# EAGLE design rocket_pack-pad (EAGLE 6.3)
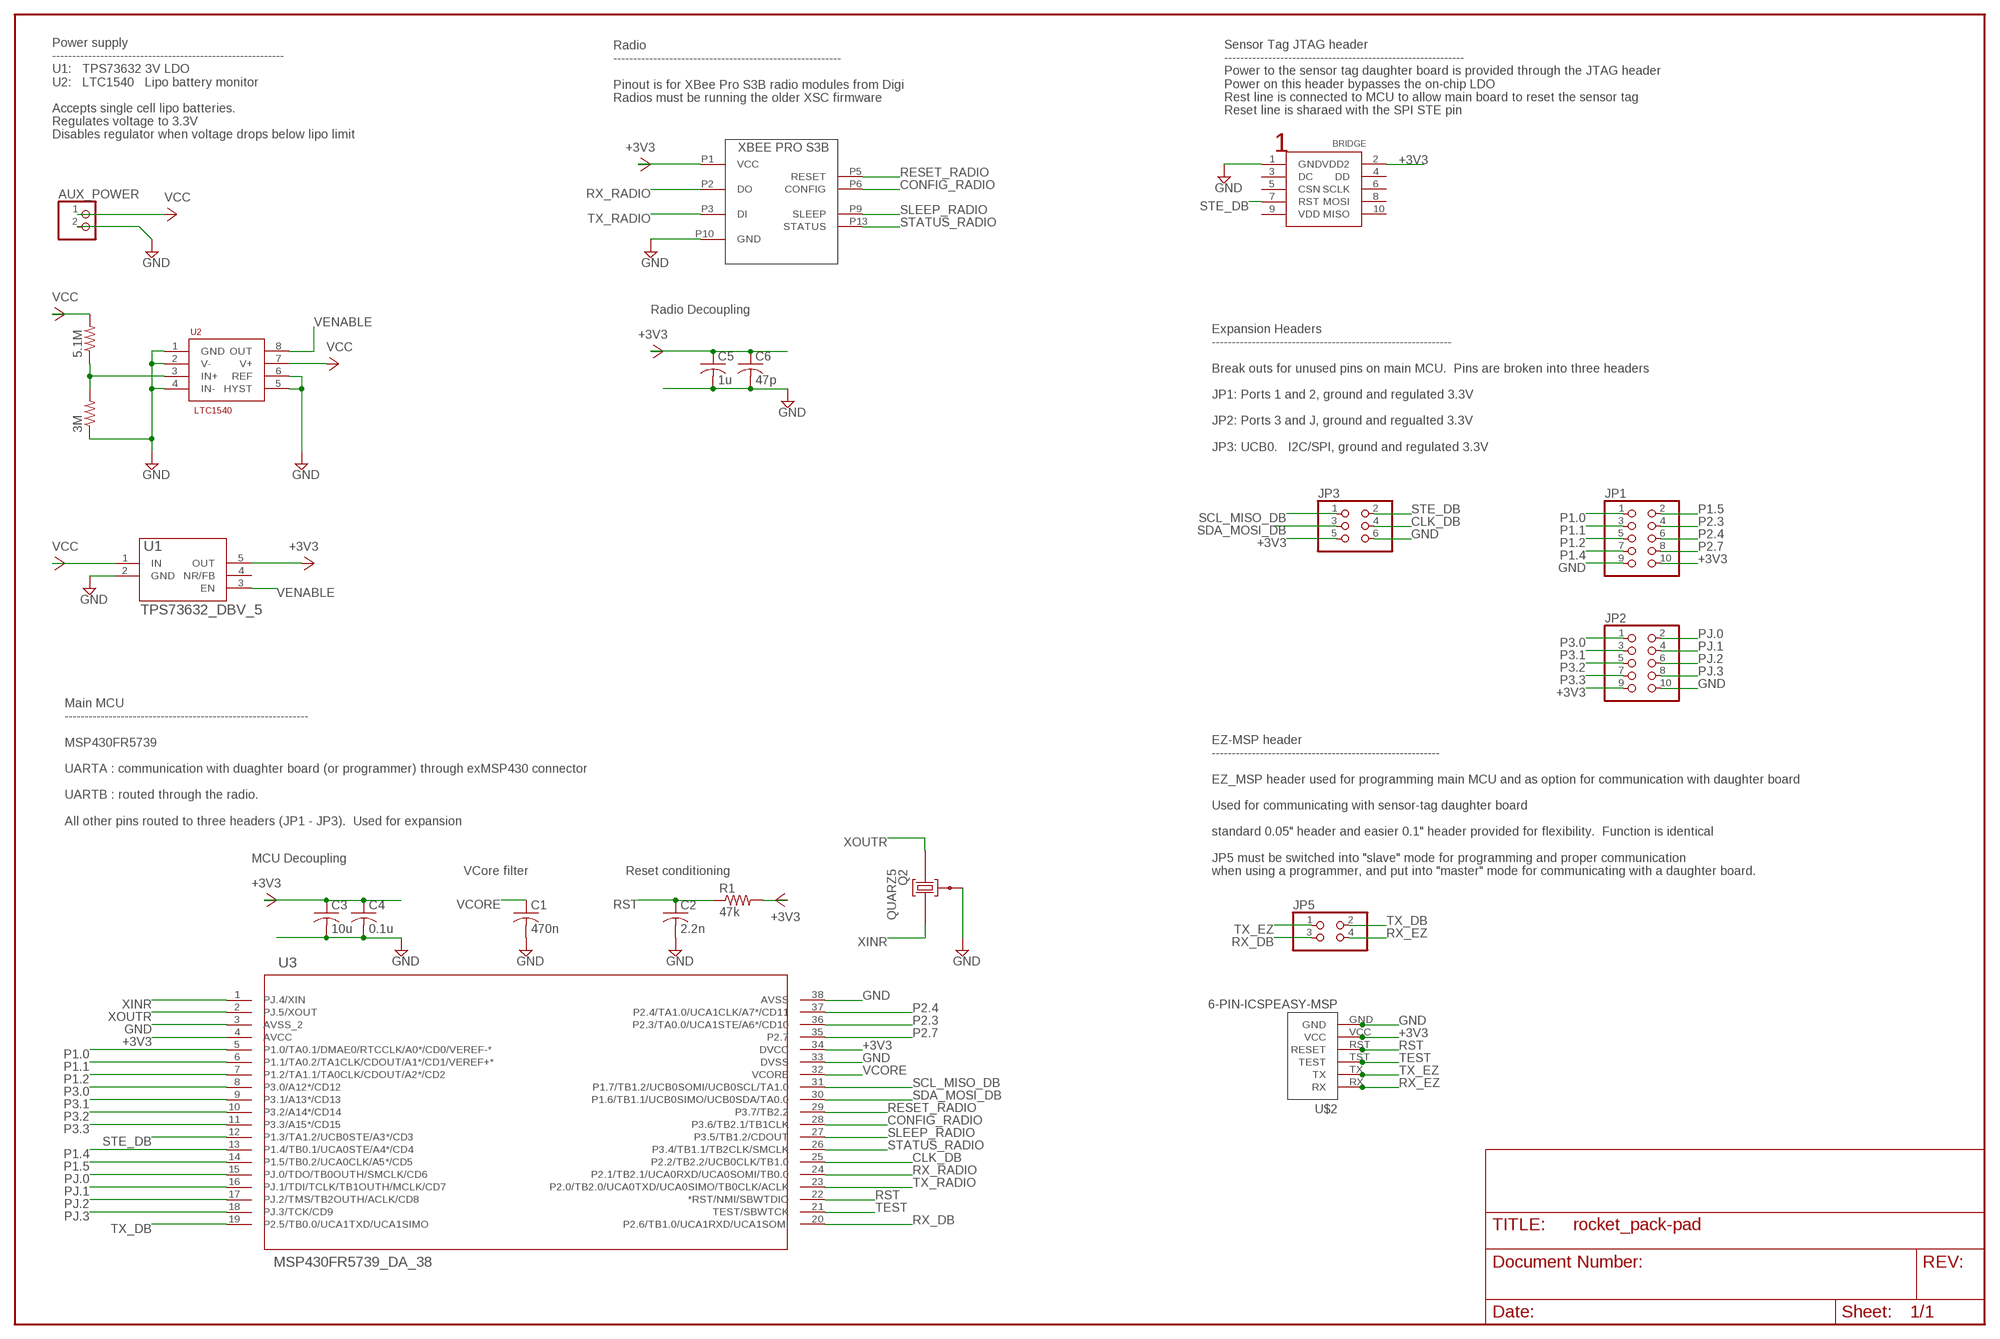
[diagram p0: schematic, sheet 1]

## Parts
3M  R-US_R1206  [R1206]
5.1M  R-US_R1206  [R1206]
AUX_POWER  PINHD-1X2  [1X02]
BRIDGE  CC-DEBUG  [2X5-1.27MM]
C1  470n  C-USC1206  [C1206]
C2  2.2n  C-USC1206  [C1206]
C3  10u  C-USC1206  [C1206]
C4  0.1u  C-USC1206  [C1206]
C5  1u  C-USC1206  [C1206]
C6  47p  C-USC1206  [C1206]
JP1  PINHD-2X5  [2X05]
JP2  PINHD-2X5  [2X05]
JP3  PINHD-2X3  [2X03]
JP5  PINHD-2X2  [2X02]
Q2  QUARZ5  [QUARZ5]
R1  47k  R-US_R1206  [R1206]
U1  TPS73632_DBV_5  [DBV5]
U2  LTC1540  [S8]
U3  MSP430FR5739_DA_38  [DA38]
U$1  XBEE_PRO_S3B  [PRO_S3B]
U$2  6-PIN-ICSPEASY-MSP  [EASYMSP-6PIN]

## Nets
+3V3: BRIDGE.2(VDD2) C3.1 C4.1 C5.1 C6.1 JP1.10 JP2.9 JP3.5 R1.2 U1.5(OUT) U3.4(AVCC) U3.34(DVCC) U$1.P1(VCC) U$2.VCC
CLK_DB: JP3.4 U3.25(P2.2/TB2.2/UCB0CLK/TB1.0)
CONFIG_RADIO: U3.28(P3.6/TB2.1/TB1CLK) U$1.P6(CONFIG)
GND: 3M.1 AUX_POWER.2 BRIDGE.1(GND) C1.2 C2.2 C3.2 C4.2 C5.2 C6.2 JP1.9 JP2.10 JP3.6 Q2.GND@0 U1.2(GND) U2.1(GND) U2.2(V-) U2.4(IN-) U2.5(HYST) U2.6(REF) U3.3(AVSS_2) U3.33(DVSS) U3.38(AVSS) U$1.P10(GND) U$2.GND
N$1: 3M.2 5.1M.1 U2.3(IN+)
P1.0: JP1.1 U3.5(P1.0/TA0.1/DMAE0/RTCCLK/A0*/CD0/VEREF-*)
P1.1: JP1.3 U3.6(P1.1/TA0.2/TA1CLK/CDOUT/A1*/CD1/VEREF+*)
P1.2: JP1.5 U3.7(P1.2/TA1.1/TA0CLK/CDOUT/A2*/CD2)
P1.4: JP1.7 U3.13(P1.4/TB0.1/UCA0STE/A4*/CD4)
P1.5: JP1.2 U3.14(P1.5/TB0.2/UCA0CLK/A5*/CD5)
P2.3: JP1.4 U3.36(P2.3/TA0.0/UCA1STE/A6*/CD10)
P2.4: JP1.6 U3.37(P2.4/TA1.0/UCA1CLK/A7*/CD11)
P2.7: JP1.8 U3.35(P2.7)
P3.0: JP2.1 U3.8(P3.0/A12*/CD12)
P3.1: JP2.3 U3.9(P3.1/A13*/CD13)
P3.2: JP2.5 U3.10(P3.2/A14*/CD14)
P3.3: JP2.7 U3.11(P3.3/A15*/CD15)
PJ.0: JP2.2 U3.15(PJ.0/TDO/TB0OUTH/SMCLK/CD6)
PJ.1: JP2.4 U3.16(PJ.1/TDI/TCLK/TB1OUTH/MCLK/CD7)
PJ.2: JP2.6 U3.17(PJ.2/TMS/TB2OUTH/ACLK/CD8)
PJ.3: JP2.8 U3.18(PJ.3/TCK/CD9)
RESET_RADIO: U3.29(P3.7/TB2.2) U$1.P5(RESET)
RST: C2.1 R1.1 U3.22(*RST/NMI/SBWTDIO) U$2.RST(RESET)
RX_DB: JP5.3 U3.20(P2.6/TB1.0/UCA1RXD/UCA1SOMI)
RX_EZ: JP5.4 U$2.RX
RX_RADIO: U3.24(P2.1/TB2.1/UCA0RXD/UCA0SOMI/TB0.0) U$1.P2(DO)
SCL_MISO_DB: JP3.1 U3.31(P1.7/TB1.2/UCB0SOMI/UCB0SCL/TA1.0)
SDA_MOSI_DB: JP3.3 U3.30(P1.6/TB1.1/UCB0SIMO/UCB0SDA/TA0.0)
SLEEP_RADIO: U3.27(P3.5/TB1.2/CDOUT) U$1.P9(SLEEP)
STATUS_RADIO: U3.26(P3.4/TB1.1/TB2CLK/SMCLK) U$1.P13(STATUS)
STE_DB: BRIDGE.7(RST) JP3.2 U3.12(P1.3/TA1.2/UCB0STE/A3*/CD3)
TEST: U3.21(TEST/SBWTCK) U$2.TST(TEST)
TX_DB: JP5.2 U3.19(P2.5/TB0.0/UCA1TXD/UCA1SIMO)
TX_EZ: JP5.1 U$2.TX
TX_RADIO: U3.23(P2.0/TB2.0/UCA0TXD/UCA0SIMO/TB0CLK/ACLK) U$1.P3(DI)
VCC: 5.1M.2 AUX_POWER.1 U1.1(IN) U2.7(V+)
VCORE: C1.1 U3.32(VCORE)
VENABLE: U1.3(EN) U2.8(OUT)
XINR: Q2.1 U3.1(PJ.4/XIN)
XOUTR: Q2.2 U3.2(PJ.5/XOUT)
Unconnected: BRIDGE.3(DC) BRIDGE.4(DD) BRIDGE.5(CSN) BRIDGE.6(SCLK) BRIDGE.8(MOSI) BRIDGE.9(VDD) BRIDGE.10(MISO) U1.4(NR/FB)

## Notes on the sheet
- Radio
  ---------------------------------------------------------
  
  Pinout is for XBee Pro S3B radio modules from Digi
  Radios must be running the older XSC firmware
- Sensor Tag JTAG header
  ------------------------------------------------------------
  Power to the sensor tag daughter board is provided through the JTAG header
  Power on this header bypasses the on-chip LDO
  Rest line is connected to MCU to allow main board to reset the sensor tag
  Reset line is sharaed with the SPI STE pin
- Power supply
  ----------------------------------------------------------
  U1:   TPS73632 3V LDO
  U2:   LTC1540   Lipo battery monitor
  
  Accepts single cell lipo batteries.  
  Regulates voltage to 3.3V
  Disables regulator when voltage drops below lipo limit
- Radio Decoupling
- Expansion Headers
  ------------------------------------------------------------
  
  Break outs for unused pins on main MCU.  Pins are broken into three headers
  
  JP1: Ports 1 and 2, ground and regulated 3.3V
  
  JP2: Ports 3 and J, ground and regualted 3.3V
  
  JP3: UCB0.   I2C/SPI, ground and regulated 3.3V
- Main MCU
  -------------------------------------------------------------
  
  MSP430FR5739
  
  UARTA : communication with duaghter board (or programmer) through exMSP430 connector
  
  UARTB : routed through the radio.  
  
  All other pins routed to three headers (JP1 - JP3).  Used for expansion
- MCU Decoupling
- VCore filter | Reset conditioning
- EZ-MSP header
  ---------------------------------------------------------
  
  EZ_MSP header used for programming main MCU and as option for communication with daughter board
  
  Used for communicating with sensor-tag daughter board
  
  standard 0.05" header and easier 0.1" header provided for flexibility.  Function is identical
  
  JP5 must be switched into "slave" mode for programming and proper communication
  when using a programmer, and put into "master" mode for communicating with a daughter board.

## Library data of the parts
3M 5.1M R1 = adafruit:R-US_: RESISTOR, American symbol
AUX_POWER = pinhead:PINHD-1X2: PIN HEADER
BRIDGE = connectors:CC-DEBUG
C1-C6 = adafruit:C-US: CAPACITOR, American symbol
JP1 JP2 = pinhead:PINHD-2X5: PIN HEADER
JP3 = pinhead:PINHD-2X3: PIN HEADER
JP5 = pinhead:PINHD-2X2: PIN HEADER
Q2 = sMSP430:QUARZ5
U1 = TexasInstruments:TPS73632_DBV_5; DATASHEETURL: http://www.ti.com/lit/gpn/TPS73632; DESCRIPTION: Single Output LDO, 400mA, Fixed(3.2V), Cap free, Low Noise, Reverse Current Protection; FAMILY_NAME: SINGLE CHANNEL LDO; GENERIC_PART_NUMBER: TPS73632; INDUSTRY_STD_PKG_TYPE: SOT-23; MANUFACTURER: Texas Instruments; MANUFACTURER_PART_NUMBER: tps73632_dbv_5; PACKAGE_DESIGNATOR: DBV; PIN_COUNT: 5; VENDOR: Texas Instruments
U2 = linear:LTC1540
U3 = TexasInstruments:MSP430FR5739_DA_38; DATASHEETURL: http://www.ti.com/lit/gpn/MSP430FR5739; DESCRIPTION: MSP430FR573x,MSP430FR572x Mixed Signal Microcontroller; FAMILY_NAME: FRAM Series; GENERIC_PART_NUMBER: MSP430FR5739; INDUSTRY_STD_PKG_TYPE: TSSOP; MANUFACTURER: Texas Instruments; MANUFACTURER_PART_NUMBER: msp430fr5739_da_38; PACKAGE_DESIGNATOR: DA; PIN_COUNT: 38; VENDOR: Texas Instruments
U$1 = xbee:XBEE_PRO_S3B
U$2 = LaunchFET:6-PIN-ICSP: 6 pin easy-msp formatted headers. Designed to make programming target boards with MSP430 Launchpad easier. EASYMSP: standard .05" pitch header to match launchpad SAFEMSP: .05" header with .025" offset Vcc to keep Geordi away

## Board
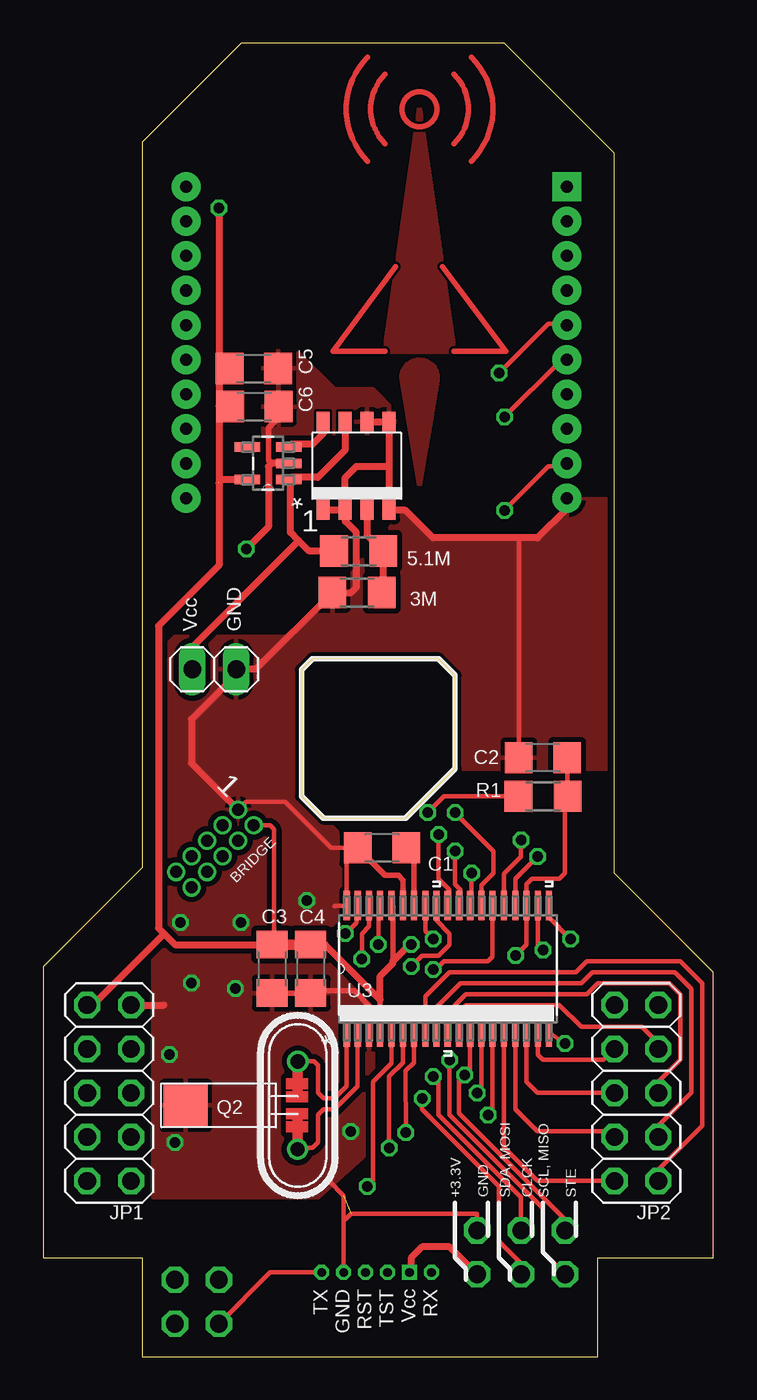
[diagram p1: board, top side]
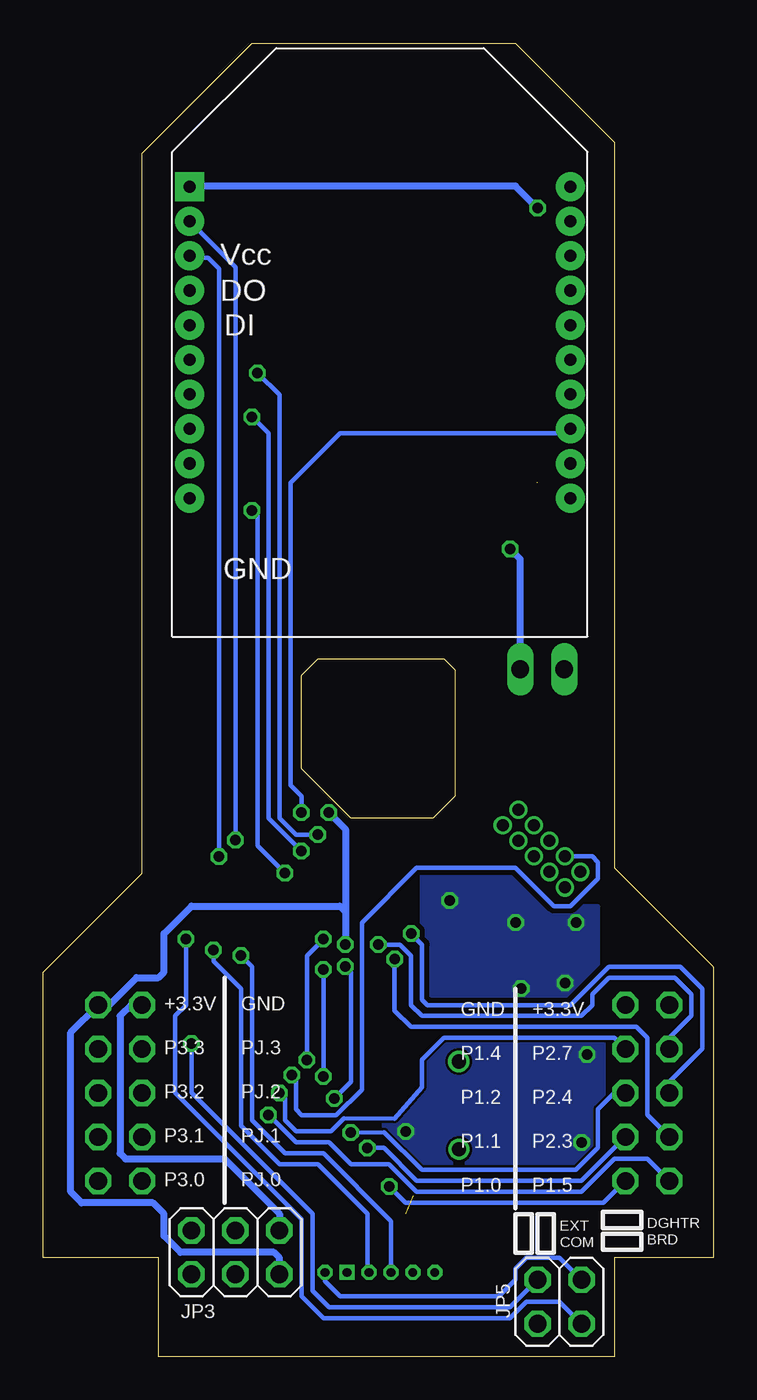
[diagram p2: board, bottom side, seen from below]

Size 38.74 x 75.88 mm. Coordinates in mm from the lower left corner, seen from the top.
Outline: 23.81,39.37 22.86,40.32 15.56,40.32 14.92,39.69 14.92,32.38 16.19,31.12 20.95,31.12 23.81,33.97 23.81,39.37
Outline: 32.07,0 32.07,5.72 38.74,5.72 38.74,22.22 33.02,27.94 33.02,69.53 26.67,75.88 11.43,75.88 5.71,70.17 5.71,28.26 0,22.54 0,5.72 5.71,5.72 5.71,0 32.07,0
Copper layers (1*16): Top 0.0356mm / dielectric 1.5011mm / Bottom 0.0356mm
Design rules "oshpark *": minimum track width 6mil, minimum drill 13mil, track to track 6mil, track to pad 6mil, pad to pad 6mil, via to via 6mil, smd to smd 6mil, copper to edge 15mil, drill to drill 6mil, minimum pad ring 7mil, minimum via ring 7mil, stop-mask expansion 4mil, vias tented up to drill 24mil, thermal gap 10mil

### Footprints (pad centres in the part's own frame; a part is rotated, then mirrored left to right if it is on the bottom)
R1206 = smd 1.6 x 1.803: 1 -1.422,0; 2 1.422,0
1X02 = drill 1.016 long: 1 -1.27,0; 2 1.27,0
2X5-1.27MM = drill 0.7 pad 1.016: 1 0,0; 2 0,1.27; 3 1.27,0; 4 1.27,1.27; 5 2.54,0; 6 2.54,1.27; 7 3.81,0; 8 3.81,1.27; 9 5.08,0; 10 5.08,1.27
C1206 = smd 1.6 x 1.8: 1 -1.4,0; 2 1.4,0
2X05 = drill 1.016 octagon: 1 -5.08,-1.27; 2 -5.08,1.27; 3 -2.54,-1.27; 4 -2.54,1.27; 5 0,-1.27; 6 0,1.27; 7 2.54,-1.27; 8 2.54,1.27; 9 5.08,-1.27; 10 5.08,1.27
2X03 = drill 1.016 octagon: 1 -2.54,-1.27; 2 -2.54,1.27; 3 0,-1.27; 4 0,1.27; 5 2.54,-1.27; 6 2.54,1.27
2X02 = drill 1.016 octagon: 1 -1.27,-1.27; 2 -1.27,1.27; 3 1.27,-1.27; 4 1.27,1.27
QUARZ5 = drill 0.813: 1 1.53,1.773; 2 1.52,-3.303 | smd 2.54 x 2.54: GND@0 -4.941,-0.762
DBV5 = smd 1.473 x 0.559: 1 -1.194,0.94; 2 -1.194,0; 3 -1.194,-0.94; 4 1.194,-0.94; 5 1.194,0.94
S8 = smd 0.762 x 1.143: 1 -2.54,-2.54; 2 -1.27,-2.54; 3 0,-2.54; 4 1.27,-2.54; 5 1.27,2.54; 6 0,2.54; 7 -1.27,2.54; 8 -2.54,2.54
DA38 = smd 1.676 x 0.356: 1 -3.658,5.842; 2 -3.658,5.207; 3 -3.658,4.547; 4 -3.658,3.912; 5 -3.658,3.251; 6 -3.658,2.591; 7 -3.658,1.956; 8 -3.658,1.295; 9 -3.658,0.66; 10 -3.658,0; 11 -3.658,-0.66; 12 -3.658,-1.295; 13 -3.658,-1.956; 14 -3.658,-2.591; 15 -3.658,-3.251; 16 -3.658,-3.912; 17 -3.658,-4.547; 18 -3.658,-5.207; 19 -3.658,-5.842; 20 3.658,-5.842; 21 3.658,-5.207; 22 3.658,-4.547; 23 3.658,-3.912; 24 3.658,-3.251; 25 3.658,-2.591; 26 3.658,-1.956; 27 3.658,-1.295; 28 3.658,-0.66; 29 3.658,0; 30 3.658,0.66; 31 3.658,1.295; 32 3.658,1.956; 33 3.658,2.591; 34 3.658,3.251; 35 3.658,3.912; 36 3.658,4.547; 37 3.658,5.207; 38 3.658,5.842
PRO_S3B = drill 0.7 pad 1.676 square: P1 -11,0 | drill 0.7 pad 1.676: P2 -11,-2; P3 -11,-4; P4 -11,-6; P5 -11,-8; P6 -11,-10; P7 -11,-12; P8 -11,-14; P9 -11,-16; P10 -11,-18; P11 11,-18; P12 11,-16; P13 11,-14; P14 11,-12; P15 11,-10; P16 11,-8; P17 11,-6; P18 11,-4; P19 11,-2; P20 11,0
EASYMSP-6PIN = drill 0.5 octagon: GND 0,-1.27; RST 0,0; RX 0,3.81; TST 0,1.27; TX 0,-2.54 | drill 0.5 square: VCC 0,2.54

### Placement (x,y rotation side)
3M  18.14,44.15 0 top
5.1M  18.23,46.54 180 top
AUX_POWER  9.88,39.72 0 top
BRIDGE  11.27,31.6 225 top
C1  19.58,29.4 180 top
C2  28.89,34.61 180 top
C3  13.23,22.41 270 top
C4  15.45,22.41 270 top
C5  12.17,57.1 0 top
C6  12.2,54.89 0 top
JP1  3.81,15.24 90 top
JP2  34.29,15.24 90 top
JP3  27.62,6.03 0 bottom
JP5  8.89,3.17 0 bottom
Q2  13.18,15.29 0 top
R1  28.89,32.38 180 top
U1  12.99,51.61 180 top
U2  18.72,51.47 0 top
U3  23.39,22.41 90 top
U$1  19.27,67.6 0 bottom
U$2  18.63,4.87 270 top

### Tracks (layer width: path | path; a pad name or v marks a point on that pad's centre or on a via)
+3V3  (via drill 0.6)  (1 unrouted)
  Top 0.254: BRIDGE.2 13.11,30.7 13.33,30.48 13.33,23.92 C3.1 | R1.2 23.18,32.38 v22.22,31.43 | v21.27,23.81 21.16,23.81
  Top 0.305: U3.4 19.47,20.64 | 20.21,22.73 20.21,22.86 20.21,25.99 U3.34 | C6.1 10.19,54.89
  Top 0.406: 20.21,22.73 19.47,21.99 19.47,20.64 16.3,23.81 C4.1 | U1.5 10.35,50.67 10.16,50.48 10.16,45.72 6.67,42.23 6.67,24.77 6.98,24.45 | 6.98,24.45 7.62,23.81 C3.1 | JP1.10 2.86,20.32 6.98,24.45 | 21.16,23.81 20.21,22.86 | v10.16,66.36 10.16,57.15 | 10.16,57.15 10.17,54.93 | 10.17,54.93 10.18,50.51 | C5.1 10.21,57.1 10.16,57.15 | C6.1 10.2,54.89 10.17,54.93 | JP3.5 23.5,6.35 21.91,6.35 21.27,5.72 21.27,4.97 U$2.VCC
  Top 0.61: C3.1 C4.1
  Bottom 0.406: v22.22,31.43 21.27,30.48 21.27,25.72 | 21.27,25.72 v21.27,23.81 | 21.27,25.72 21.59,26.04 30.16,26.04 31.75,24.45 31.75,22.22 32.07,21.91 33.34,21.91 34.93,20.32 JP2.9 37.15,18.73 37.15,9.52 36.51,8.89 32.38,8.89 31.75,8.25 31.75,6.99 30.8,6.03 25.4,6.03 25.08,5.72 JP3.5 | v10.16,66.36 11.43,67.63 30.25,67.63 U$1.P1
CLK_DB  (via drill 0.6)
  Top 0.254: JP3.4 27.62,9.21 22.86,13.97 22.86,15.88 v22.54,16.19 | U3.25 25.98,23.12 25.72,22.86 23.18,22.86 22.69,22.37 v22.54,22.37
  Bottom 0.254: v22.54,22.37 v22.54,16.19
CONFIG_RADIO  (via drill 0.6)
  Top 0.254: v23.81,29.21 23.81,27.31 24.13,26.99 24.13,26.15 U3.28 | v26.67,54.29 29.84,57.47 30.13,57.47 U$1.P6
  Bottom 0.254: v23.81,29.21 25.72,31.12 25.72,53.34 v26.67,54.29
GND  (via drill 0.6)  (1 unrouted)
  Top 0.254: JP3.6 25.08,8.25 17.78,8.25 17.46,7.94 | U$2.GND 17.36,9.31 16.51,10.16 | C1.2 17.46,29.4 | 17.46,29.4 16.64,29.4 13.97,32.07 11.73,32.07 BRIDGE.1 | C2.2 27.49,47.18 27.62,47.31 | 17.46,29.4 17.54,29.31 U3.38 16.86,26.07 16.83,26.04
  Top 0.305: C3.2 C4.2 15.58,21.14 17.99,21.14 18.84,20.29 U3.3 | U3.33 20.79,27.54 20.53,27.81 19.76,27.81 C1.2 | C6.2 13.6,54.24 13.02,53.66 13.02,51.79 13.2,51.61
  Top 0.406: U2.6 U2.5 19.99,51.44 | 19.99,51.44 U2.4 20.03,48.89 20.95,48.89 22.54,47.31 27.62,47.31 28.57,47.31 30.27,49 U$1.P10 | U2.1 U2.2 | U2.2 17.45,50.79 18.1,51.44 19.99,51.44 | U2.2 17.46,48.92 17.46,48.26 18.1,47.63 18.1,44.45 17.79,44.15 3M.1 12.29,39.72 11.46,39.72 | U1.2 13.2,51.61 13.02,51.44 13.02,47.94 v11.75,46.67 | AUX_POWER.2 11.46,39.72 | 11.46,39.72 8.57,36.83 8.57,34.3 BRIDGE.1 | JP1.9 6.98,20.32
  Bottom 0.406: AUX_POWER.2 11.15,46.08 v11.75,46.67 | JP2.10 33.66,20.32 34.29,19.68 34.29,11.75 33.97,11.43 28.26,11.43 25.08,8.25 JP3.6
  other vias: 8.57,21.59 7.94,25.08 11.43,25.08 11.11,21.27 15.24,26.35 7.3,17.46 17.78,13.02 7.62,12.38
  pour Top (isolate 0.305): 16.51,23.81 6.35,23.81 6.35,9.21 15.88,9.21 19.05,12.06 19.05,20.64 17.78,21.91
  pour Top (isolate 0.305): 6.67,24.13 15.88,24.13 17.14,25.4 17.14,30.16 14.92,32.38 14.92,40.32 22.86,40.32 23.81,39.37 23.81,33.97 32.7,33.97 32.7,49.53 30.48,49.53 30.48,49.21 28.57,47.31 22.54,47.31 20.95,48.89 14.61,41.59 7.62,41.59 6.67,40.64
  pour Bottom (isolate 0.305): 6.67,26.04 9.21,26.04 11.43,28.26 16.83,28.26 16.83,20.64 16.51,20.32 6.67,20.32
  pour Top: 12.7,58.1 14.61,58.1 16.83,55.88 19.05,55.88 20.32,54.61 20.32,53.34 12.7,53.34
  pour Bottom: 6.35,18.41 6.35,12.38 7.94,10.79 16.83,10.79 19.05,13.02 19.05,15.24 15.56,18.41
N$1
  Top 0.406: U2.3 18.72,47.47 5.1M.1 19.65,44.24 3M.2
N$5
  Top 0.305: 19.75,70.08 arc-90 19.75,74.08
N$6
  pour Top: 21.75,72.08 19.75,58.08 23.75,58.08
N$7
  Top 0.305: 23.75,74.08 arc-90 23.75,70.08
N$8
  Top 0.305: 18.75,69.08 arc-90 18.75,75.08
N$9
  Top 0.305: 24.75,75.08 arc-90 24.75,69.08
N$10
  Top 0.305: 19.75,58.08 16.75,58.08 20.36,62.98
N$11
  Top 0.305: 23.75,58.08 26.75,58.08 23.09,62.98
N$12
  pour Top: 21.75,50.4 20.75,56.4 arc-199 22.75,56.4
P1.0  (via drill 0.6)
  Top 0.254: U3.5 20.13,16.96 19.05,15.88 19.05,10.16 v18.73,9.84
  Bottom 0.254: v18.73,9.84 17.78,8.89 6.35,8.89 JP1.1
P1.1  (via drill 0.6)
  Top 0.254: U3.6 20.79,16.99 20,16.19 v20,12.06
  Bottom 0.254: v20,12.06 19.05,12.06 17.14,10.16 7.62,10.16 JP1.3
P1.2  (via drill 0.6)
  Top 0.254: U3.7 21.43,16.99 20.95,16.51 v20.96,12.94
  Bottom 0.254: v20.96,12.94 19.04,12.96 16.83,10.79 7.94,10.79 6.67,12.06 6.67,14.29 5.71,15.24 JP1.5
P1.4  (via drill 0.6)
  Top 0.254: U3.13 25.34,15.5 v25.08,15.24
  Bottom 0.254: JP1.7 5.71,18.41 15.56,18.41 16.83,17.15 16.83,15.56 18.41,13.76 21.36,13.77 22.09,13.02 24.13,13.02 24.77,13.65 24.77,14.92 v25.08,15.24
P1.5  (via drill 0.6)
  Top 0.254: U3.14 25.98,14.23 v25.72,13.97
  Bottom 0.254: v25.72,13.97 24.13,12.38 22.22,12.38 20.95,11.11 18.73,11.11 17.14,9.52 7.62,9.52 5.71,11.43 3.81,11.43 JP1.2
P2.3  (via drill 0.6)
  Top 0.254: U3.36 18.84,24.87 18.41,24.45 v18.41,22.97
  Bottom 0.254: JP1.4 3.81,13.97 3.81,18.41 4.45,19.05 17.46,19.05 18.41,20 v18.41,22.97
P2.4  (via drill 0.6)
  Top 0.254: v17.46,24.45 18.1,25.08 18.1,25.99 U3.37
  Bottom 0.254: JP1.6 2.54,15.88 0.64,17.78 0.64,21.27 1.91,22.54 6.03,22.54 8.26,20.32 16.51,20.32 16.83,20.64 16.83,23.81 v17.46,24.45
P2.7  (via drill 0.6)
  Top 0.254: v19.37,23.81 19.37,25.96 U3.35
  Bottom 0.254: JP1.8 2.54,18.41 1.27,19.68 1.27,20.95 2.22,21.91 6.03,21.91 6.98,20.95 6.98,20.32 7.62,19.68 16.83,19.68 17.46,20.32 17.46,23.18 18.1,23.81 v19.37,23.81
P3.0
  Top 0.254: JP2.1 35.56,10.79 38.1,13.34 38.1,21.59 36.83,22.86 31.43,22.86 30.8,22.22 23.5,22.22 22.09,20.82 U3.8
P3.1
  Top 0.254: JP2.3 35.56,13.34 37.47,15.24 37.47,21.27 36.51,22.22 31.75,22.22 31.11,21.59 24.13,21.59 22.73,20.19 U3.9
P3.2
  Top 0.254: JP2.5 35.56,15.88 36.83,17.15 36.83,20.95 36.2,21.59 32.07,21.59 31.43,20.95 24.45,20.95 23.39,19.89 U3.10
P3.3
  Top 0.254: JP2.7 35.56,18.1 34.61,19.05 31.11,19.05 29.84,20.32 24.45,20.32 24.13,20 24.13,18.84 U3.11
PJ.0
  Top 0.254: U3.15 26.64,12.1 28.57,10.16 JP2.2
PJ.1
  Top 0.254: U3.16 27.3,14.29 28.57,13.02 32.7,13.02 JP2.4
PJ.2
  Top 0.254: U3.17 27.93,15.88 28.57,15.24 JP2.6
PJ.3
  Top 0.254: U3.18 28.59,17.44 28.89,17.15 32.38,17.15 JP2.8
RESET_RADIO  (via drill 0.6)
  Top 0.254: v22.86,30.16 22.86,27.62 23.5,26.99 23.5,26.18 U3.29 | v26.35,56.83 29.21,59.69 30.18,59.69 U$1.P5
  Bottom 0.254: v22.86,30.16 24.13,30.16 25.08,31.12 25.08,55.56 v26.35,56.83
RST  (via drill 0.6)
  Top 0.254: v27.3,23.18 27.94,23.81 27.94,26.06 U3.22 27.93,27.3 28.26,27.62 29.84,27.62 30.16,27.94 30.16,32.23 R1.1 30.29,32.41 C2.1
  Top 0.305: U3.22 27.91,26.09
  Bottom 0.254: U$2.RST 18.63,7.84 22.54,11.75 24.77,11.75 26.67,13.65 26.67,22.54 v27.3,23.18
RX_DB  (via drill 0.6)
  Top 0.254: U3.20 29.23,25.38 v30.48,24.13
  Bottom 0.254: v30.48,24.13 30.48,20.32 31.11,19.68 31.11,15.24 23.81,7.94 23.81,3.49 22.54,2.22 11.75,2.22 10.79,3.17 8.89,3.17 JP5.3
RX_EZ
  Bottom 0.254: U$2.RX 22.45,4.35 21.59,3.49 12.38,3.49 11.43,4.44 11.43,5.08 10.79,5.72 8.89,5.72 JP5.4
RX_RADIO  (via drill 0.6)
  Top 0.254: U3.24 26.64,27.91 27.62,28.89 v27.62,29.84
  Bottom 0.254: v27.62,29.84 27.62,62.95 U$1.P2
SCL_MISO_DB  (via drill 0.6)
  Top 0.254: JP3.1 28.89,6.03 28.89,8.57 23.5,13.97 v23.5,17.15 | U3.31 22.09,24.58 v22.54,24.13
  Bottom 0.254: v23.5,17.15 23.5,23.18 v22.54,24.13
SDA_MOSI_DB  (via drill 0.6)
  Top 0.254: JP3.3 27.62,5.4 26.35,6.67 26.35,9.84 21.91,14.29 v21.91,14.92 | v21.27,22.54 21.91,23.18 22.86,23.18 23.5,23.81 23.5,24.45 22.73,25.22 U3.30
  Bottom 0.254: v21.91,14.92 20.95,15.88 20.95,22.22 v21.27,22.54
SLEEP_RADIO  (via drill 0.6)
  Top 0.254: v24.77,27.94 24.77,26.15 U3.27 | v26.67,48.89 29.21,51.44 30.1,51.44 U$1.P9
  Bottom 0.254: v24.77,27.94 26.35,29.53 26.35,48.58 v26.67,48.89
STATUS_RADIO  (via drill 0.6)
  Top 0.254: U3.26 25.34,27.25 26.04,27.94 26.04,29.21 v23.81,31.43
  Bottom 0.254: v23.81,31.43 23.81,32.38 24.45,33.02 24.45,50.48 21.59,53.34 8.53,53.34 U$1.P13
STE_DB  (via drill 0.6)
  Top 0.254: U3.12 24.68,16.6 v24.36,16.28 24.05,15.96 24.05,14.05 30.16,7.94 JP3.2
  Bottom 0.254: BRIDGE.7 7,28.91 6.67,28.57 6.67,27.62 8.26,26.04 9.21,26.04 11.43,28.26 17.14,28.26 20.32,25.08 20.32,15.43 21.8,13.95 23.79,13.95 24.13,14.29 24.13,16.05 v24.36,16.28
TEST  (via drill 0.6)
  Top 0.254: U3.21 28.59,23.79 v28.89,23.49
  Bottom 0.254: v28.89,23.49 28.89,22.86 27.3,21.27 27.3,13.34 25.08,11.11 22.86,11.11 20,8.25 20,4.97 U$2.TST
TX_DB  (via drill 0.6)
  Top 0.254: U3.19 30.14,18.12 v30.16,18.1
  Bottom 0.254: v30.16,18.1 30.16,15.24 23.18,8.25 23.18,3.81 22.22,2.86 11.75,2.86 JP5.2
TX_EZ
  Top 0.254: U$2.TX 13.13,4.87 JP5.1
TX_RADIO  (via drill 0.6)
  Top 0.254: U3.23 27.3,27.62 v28.57,28.89
  Bottom 0.254: v28.57,28.89 28.57,62.87 29.21,63.5 30.17,63.5 U$1.P3
VCC
  Top 0.406: U2.7 17.45,52.38 15.88,50.8 14.31,50.8 U1.1 14.29,50.57 14.29,47.63 14.76,47.15 | 5.1M.2 15.37,46.54 14.76,47.15 | AUX_POWER.1 8.62,41 14.76,47.15
VCORE
  Top 0.305: U3.32 21.43,28.94 C1.1
VENABLE
  Top 0.406: U2.8 16.18,53.33 15.56,52.7 14.34,52.7 U1.3
XINR
  Top 0.254: Q2.1 15.64,17.06 15.88,16.83 15.88,15.24 16.19,14.92 16.83,14.92 17.54,15.64 17.54,18.16
  Top 0.305: 17.54,18.16 U3.1
XOUTR
  Top 0: 14.79,12.06 Q2.2
  Top 0.254: 14.79,12.06 15.56,12.06 15.88,12.38 15.88,13.97 16.19,14.29 16.83,14.29 18.18,15.64 U3.2
(copper drawn outside any net)
  shapes: Top circle x1

### Text on the board
tPlace: Vcc | GND
bPlace: +3.3V | GND | GND | +3.3V | P2.7 | P1.4 | PJ.3 | P3.3 | P2.4 | P1.2 | PJ.2 | P3.2 | PJ.1 | P3.1 | P2.3 | P1.1 | P1.5 | P1.0 | PJ.0 | P3.0
_tsilk: +3.3V | GND | SDA, MOSI | CLCK | SCL, MISO | STE
_bsilk: Vcc | DO | DI | GND | DGHTR | EXT | BRD | COM